# EAGLE schematic PowerElectronicsSchematics (EAGLE 6.5.0)

## Sheet 1 of 6
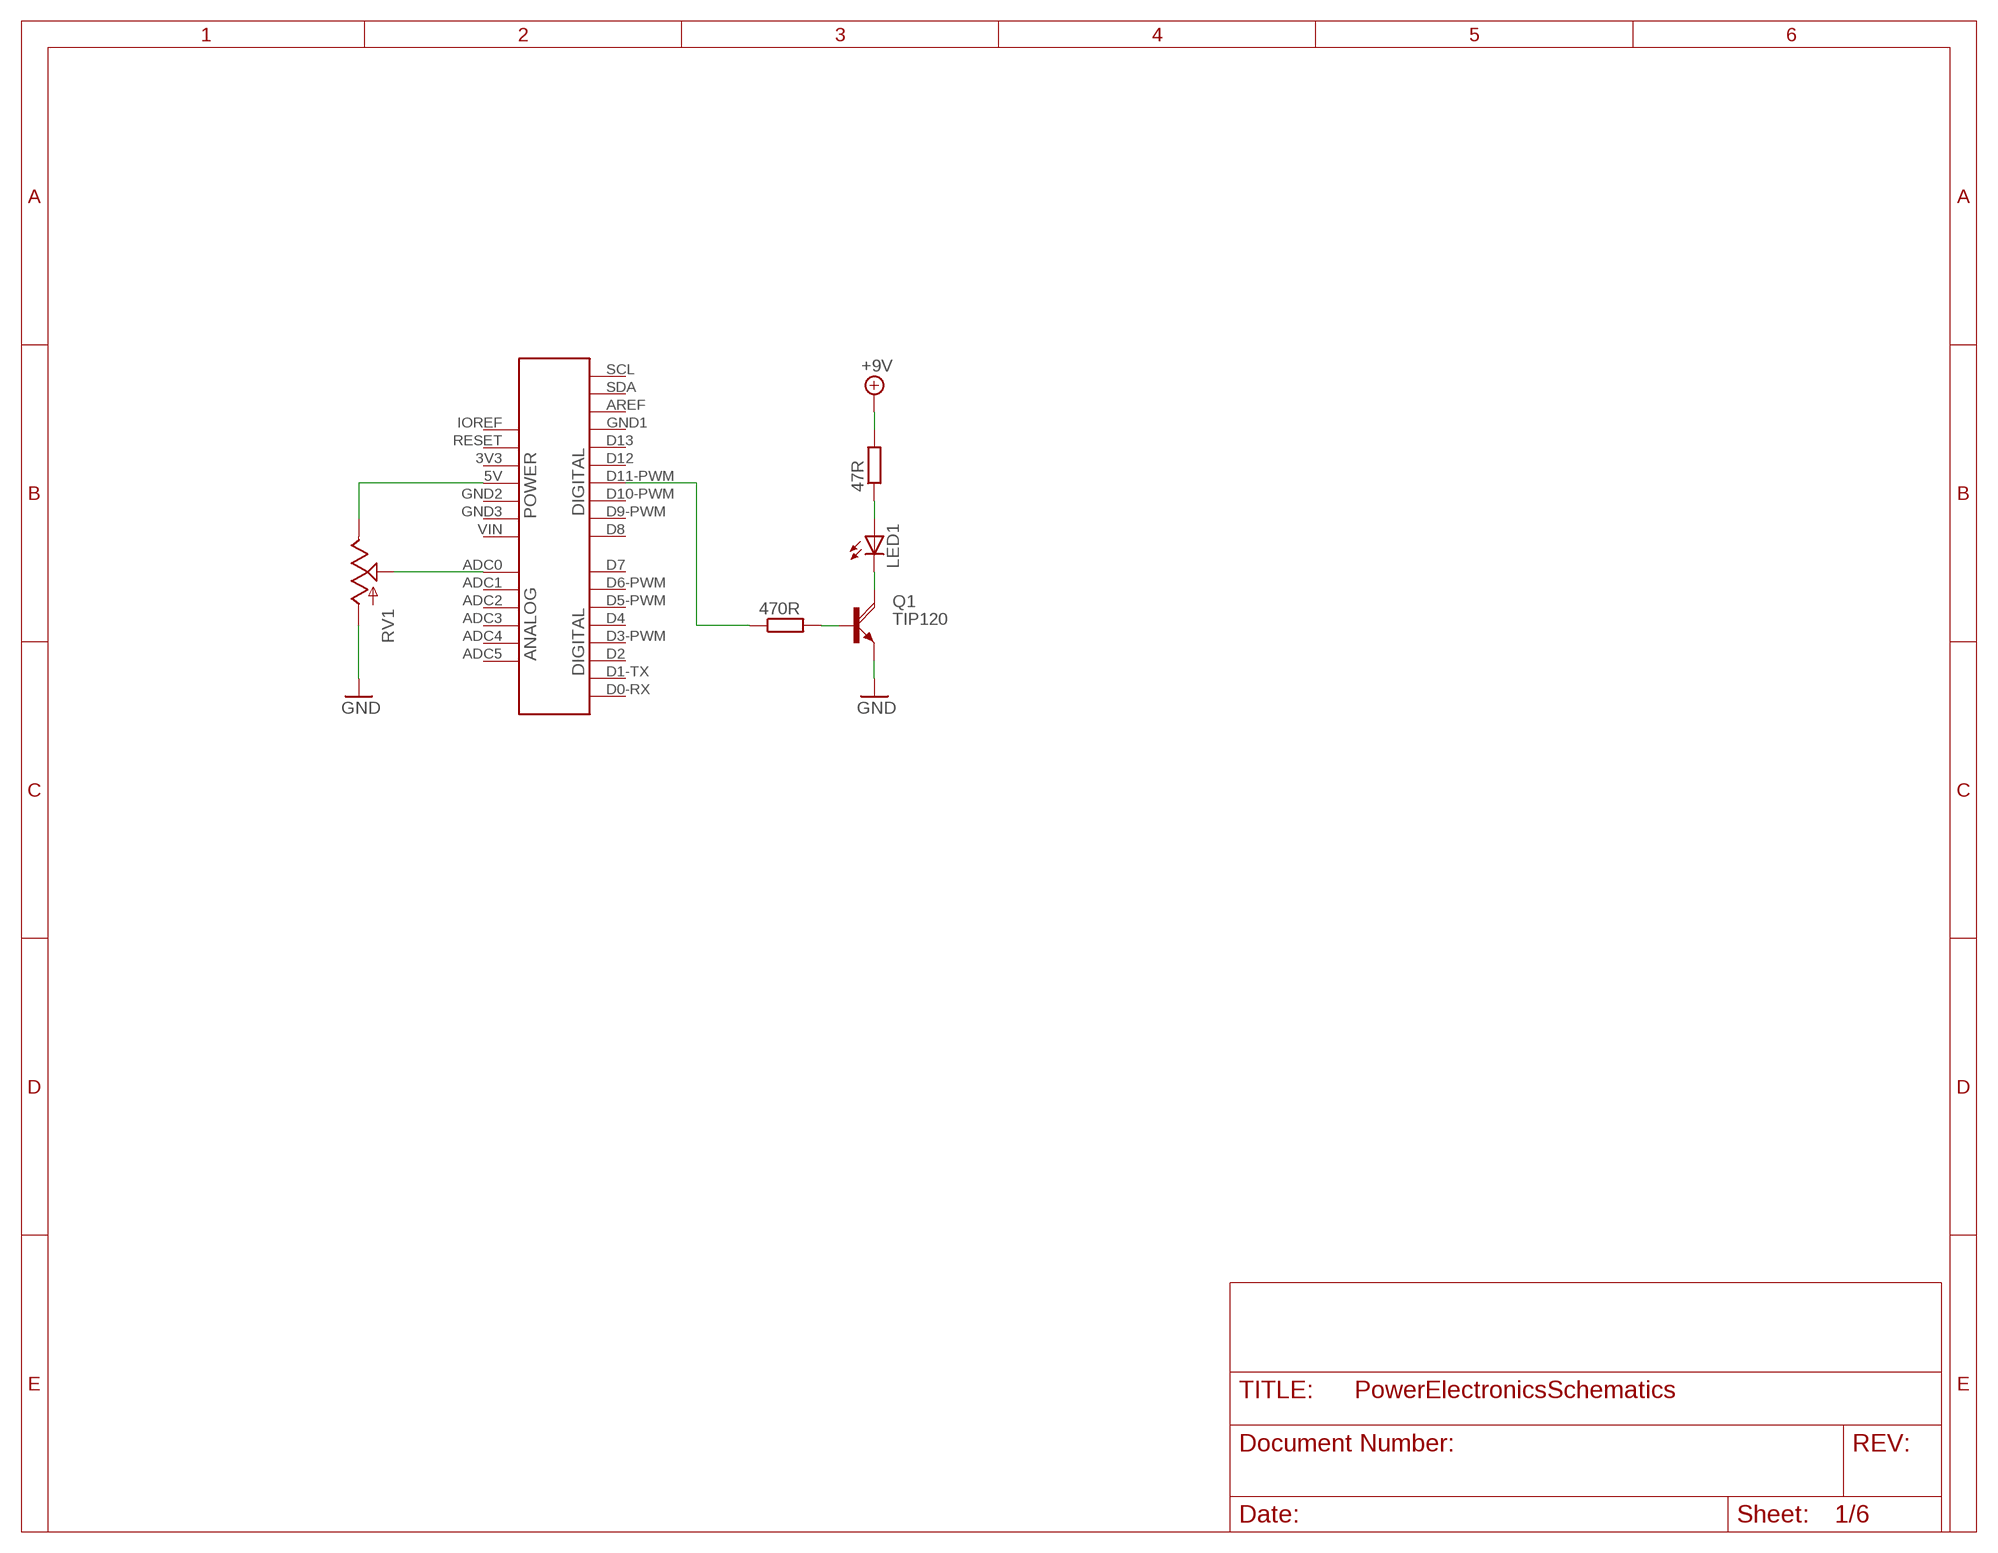
[diagram p0: schematic, sheet 1]

### Parts
47R  R-EU_R0603  [R0603]
470R  R-EU_R0603  [R0603]
ARD1  UNO-R3  [UNO-R3]
LED1  LEDB155  [Q62902-B155]
Q1  TIP120  [TO220AH]
RV1  POT  [ALPS_POT]

### Nets
+9V: 47R.2 ; also sheet 2,3,4,5,6
GND: Q1.E RV1.P$3(A) ; also sheet 2,3,4,5,6
N$1: 470R.1 ARD1.D11-PWM(D11)
N$2: 470R.2 Q1.B
N$3: 47R.1 LED1.A
N$4: LED1.K(C) Q1.C
N$5: ARD1.ADC0 RV1.P$2(S)
N$6: ARD1.5V RV1.P$1(E)
Unconnected: ARD1.3V3 ARD1.ADC1 ARD1.ADC2 ARD1.ADC3 ARD1.ADC4 ARD1.ADC5 ARD1.AREF ARD1.D0-RX(D0) ARD1.D1-TX(D1) ARD1.D2 ARD1.D3-PWM(D3) ARD1.D4 ARD1.D5-PWM(D5) ARD1.D6-PWM(D6) ARD1.D7 ARD1.D8 ARD1.D9-PWM(D9) ARD1.D10-PWM(D10) ARD1.D12 ARD1.D13 ARD1.GND1 ARD1.GND2 ARD1.GND3 ARD1.IOREF ARD1.RESET ARD1.SCL ARD1.SDA ARD1.VIN

## Sheet 2 of 6
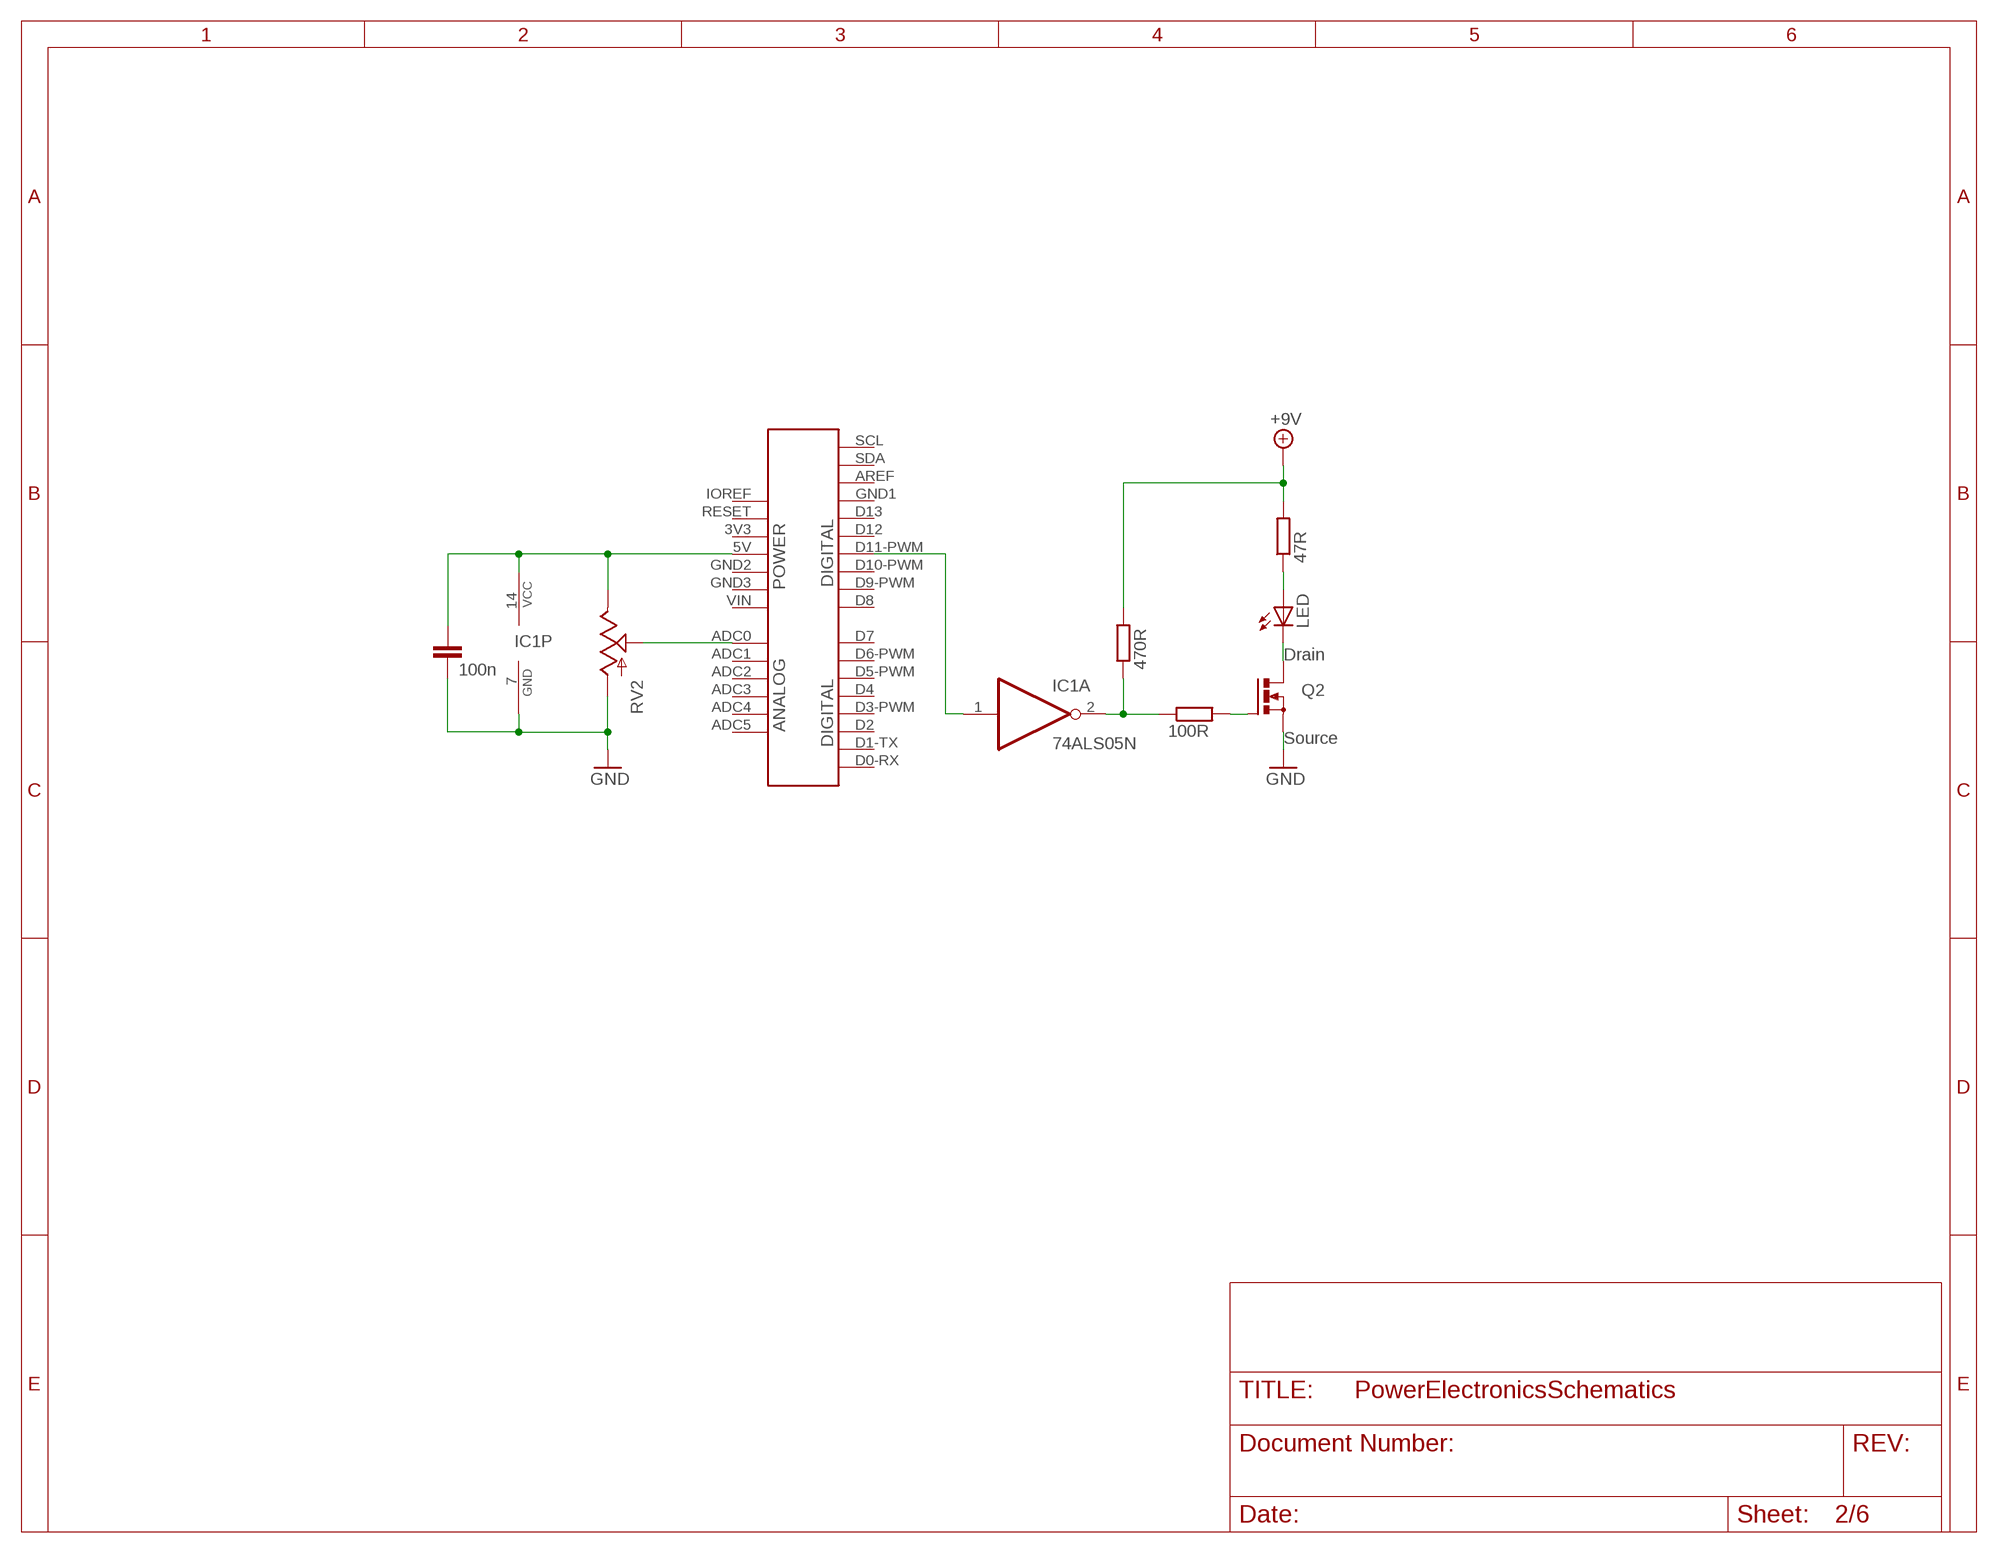
[diagram p1: schematic, sheet 2]

### Parts
47R1  47R  R-EU_R0603  [R0603]
470R1  100R  R-EU_R0603  [R0603]
470R2  470R  R-EU_R0603  [R0603]
ARD2  UNO-R3  [UNO-R3]
C1  100n  C-EUC0603  [C0603]
IC1  74ALS05N  [DIL14]
LED2  LED  LEDB155  [Q62902-B155]
Q2  P3N100FI  [IW220B]
RV2  POT  [ALPS_POT]

### Nets
+9V: 47R1.2 470R2.2 ; also sheet 1,3,4,5,6
GND: C1.2 IC1.7(P:GND) Q2.S RV2.P$3(A) ; also sheet 1,3,4,5,6
N$7: ARD2.D11-PWM(D11) IC1.1(A:I)
N$8: LED2.K(C) Q2.D
N$9: 47R1.1 LED2.A
N$10: 470R1.2 Q2.G
N$11: ARD2.ADC0 RV2.P$2(S)
N$12: ARD2.5V C1.1 IC1.14(P:VCC) RV2.P$1(E)
N$13: 470R1.1 470R2.1 IC1.2(A:O)
Unconnected: ARD2.3V3 ARD2.ADC1 ARD2.ADC2 ARD2.ADC3 ARD2.ADC4 ARD2.ADC5 ARD2.AREF ARD2.D0-RX(D0) ARD2.D1-TX(D1) ARD2.D2 ARD2.D3-PWM(D3) ARD2.D4 ARD2.D5-PWM(D5) ARD2.D6-PWM(D6) ARD2.D7 ARD2.D8 ARD2.D9-PWM(D9) ARD2.D10-PWM(D10) ARD2.D12 ARD2.D13 ARD2.GND1 ARD2.GND2 ARD2.GND3 ARD2.IOREF ARD2.RESET ARD2.SCL ARD2.SDA ARD2.VIN IC1.3(B:I) IC1.4(B:O) IC1.5(C:I) IC1.6(C:O) IC1.8(D:O) IC1.9(D:I) IC1.10(E:O) IC1.11(E:I) IC1.12(F:O) IC1.13(F:I)

### Notes on the sheet
- Drain
- Source

## Sheet 3 of 6
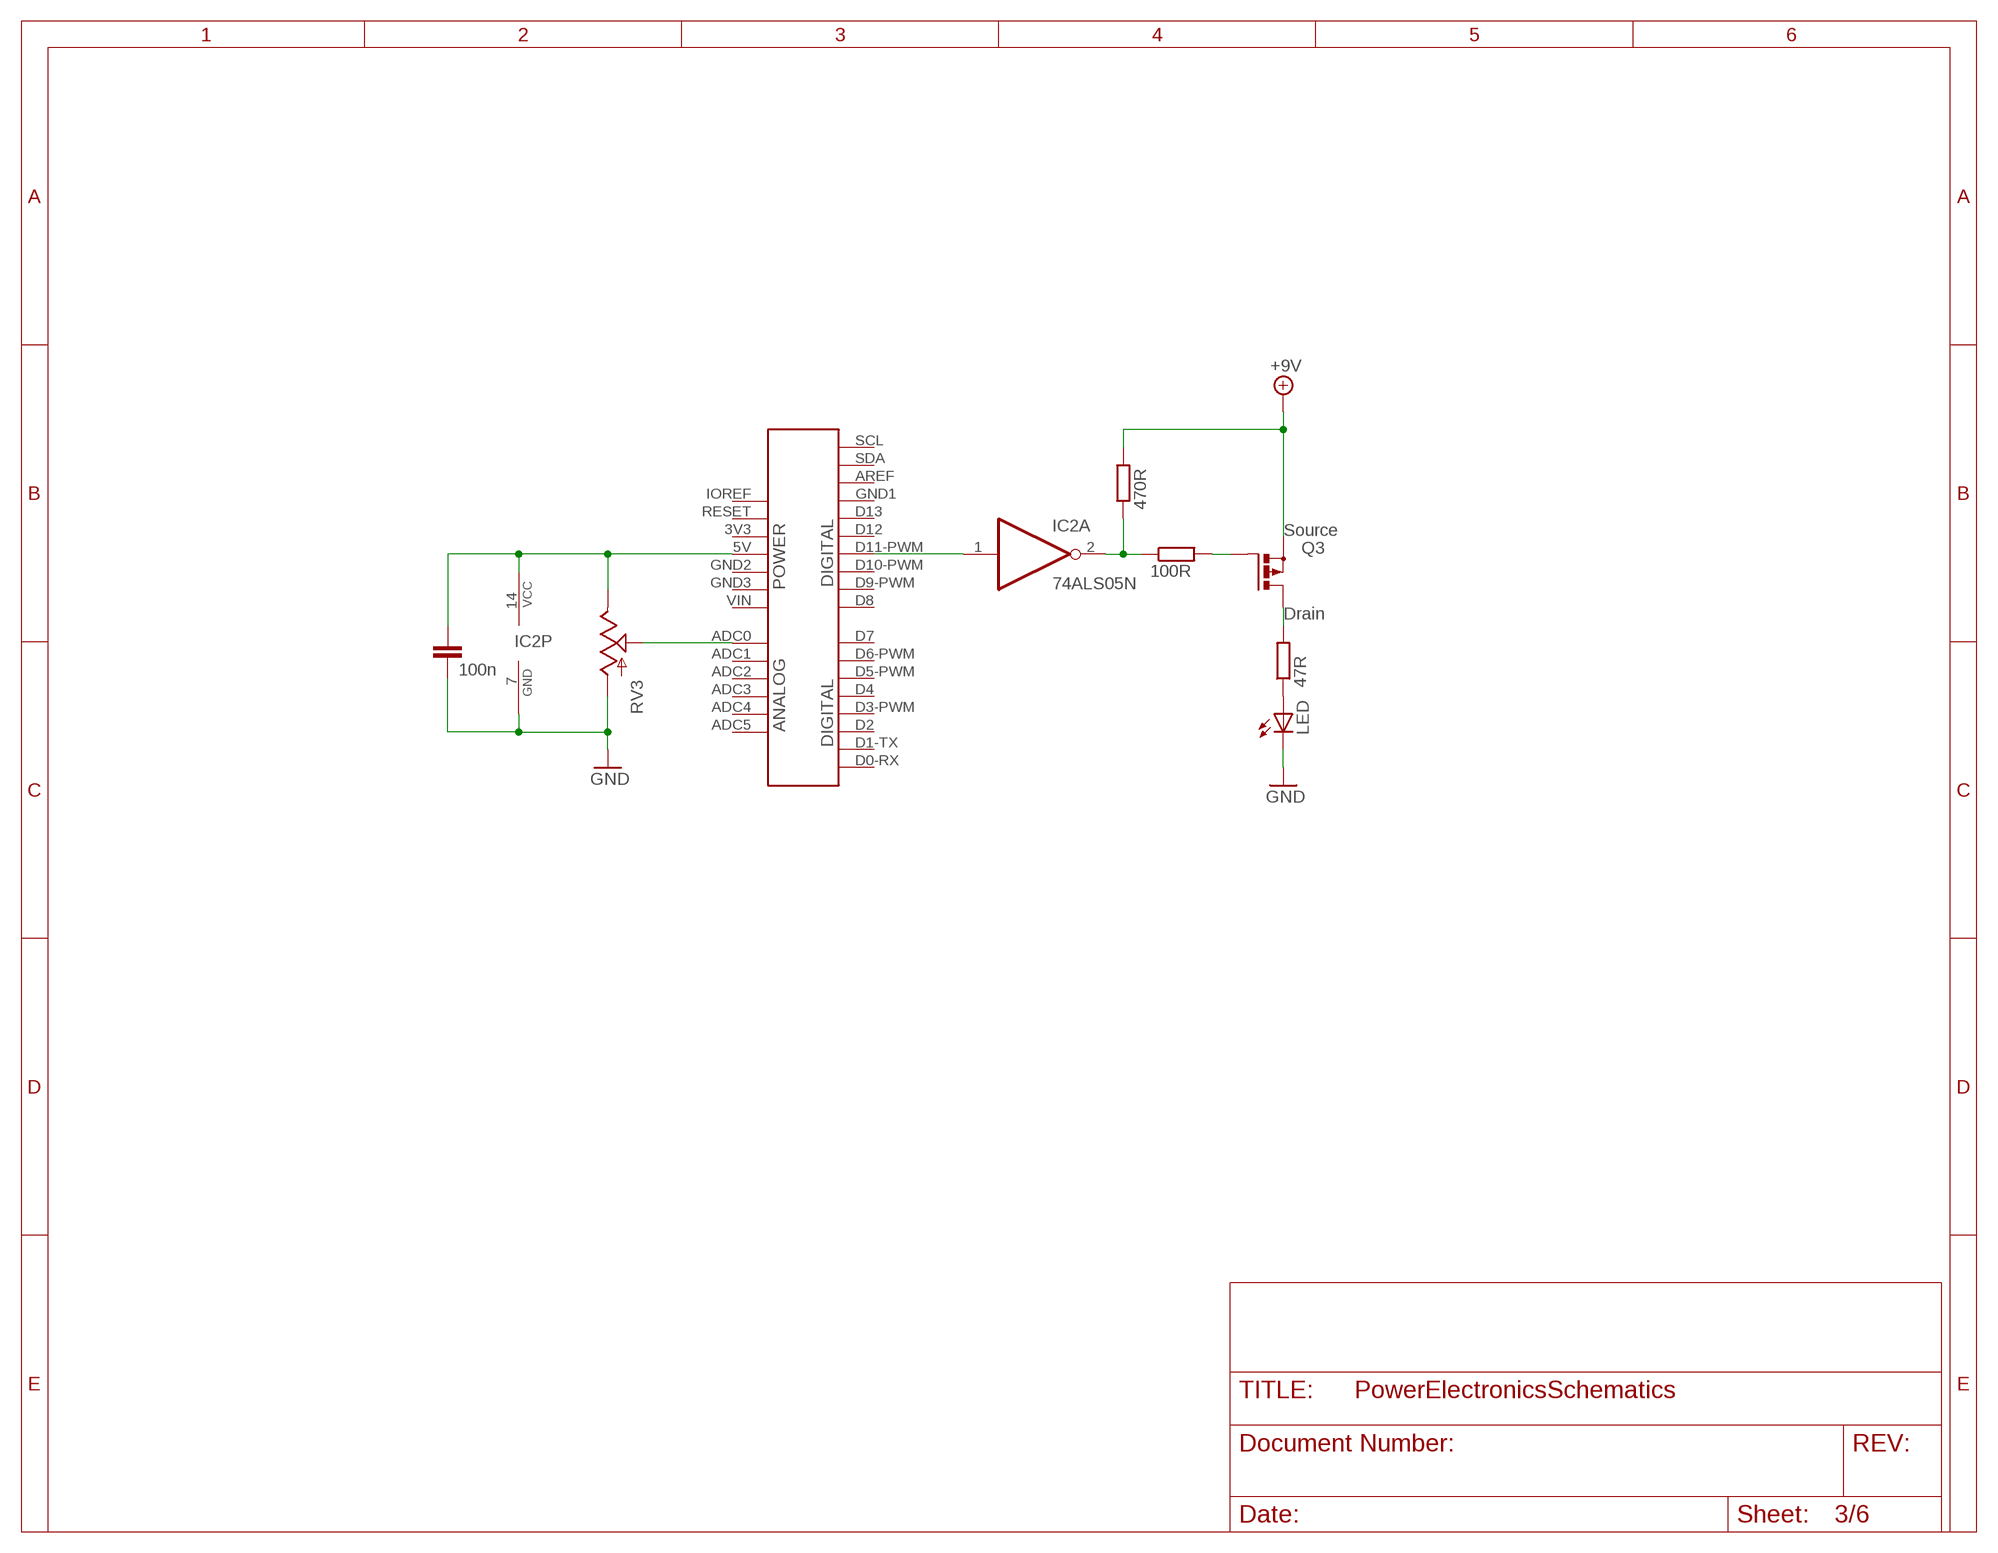
[diagram p2: schematic, sheet 3]

### Parts
47R2  47R  R-EU_R0603  [R0603]
470R3  100R  R-EU_R0603  [R0603]
470R4  470R  R-EU_R0603  [R0603]
ARD3  UNO-R3  [UNO-R3]
C2  100n  C-EUC0603  [C0603]
IC2  74ALS05N  [DIL14]
LED3  LED  LEDB155  [Q62902-B155]
Q3  P-MOSFET-SO8  [SO-08]
RV3  POT  [ALPS_POT]

### Nets
+9V: 470R4.2 Q3.1(S) Q3.2(S) Q3.3(S) ; also sheet 1,2,4,5,6
GND: C2.2 IC2.7(P:GND) LED3.K(C) RV3.P$3(A) ; also sheet 1,2,4,5,6
N$14: ARD3.D11-PWM(D11) IC2.1(A:I)
N$15: 47R2.1 LED3.A
N$16: ARD3.ADC0 RV3.P$2(S)
N$17: ARD3.5V C2.1 IC2.14(P:VCC) RV3.P$1(E)
N$18: 47R2.2 Q3.5(D) Q3.6(D) Q3.7(D) Q3.8(D)
N$19: 470R3.2 Q3.4(G)
N$20: 470R3.1 470R4.1 IC2.2(A:O)
Unconnected: ARD3.3V3 ARD3.ADC1 ARD3.ADC2 ARD3.ADC3 ARD3.ADC4 ARD3.ADC5 ARD3.AREF ARD3.D0-RX(D0) ARD3.D1-TX(D1) ARD3.D2 ARD3.D3-PWM(D3) ARD3.D4 ARD3.D5-PWM(D5) ARD3.D6-PWM(D6) ARD3.D7 ARD3.D8 ARD3.D9-PWM(D9) ARD3.D10-PWM(D10) ARD3.D12 ARD3.D13 ARD3.GND1 ARD3.GND2 ARD3.GND3 ARD3.IOREF ARD3.RESET ARD3.SCL ARD3.SDA ARD3.VIN IC2.3(B:I) IC2.4(B:O) IC2.5(C:I) IC2.6(C:O) IC2.8(D:O) IC2.9(D:I) IC2.10(E:O) IC2.11(E:I) IC2.12(F:O) IC2.13(F:I)

### Notes on the sheet
- Source
- Drain

## Sheet 4 of 6
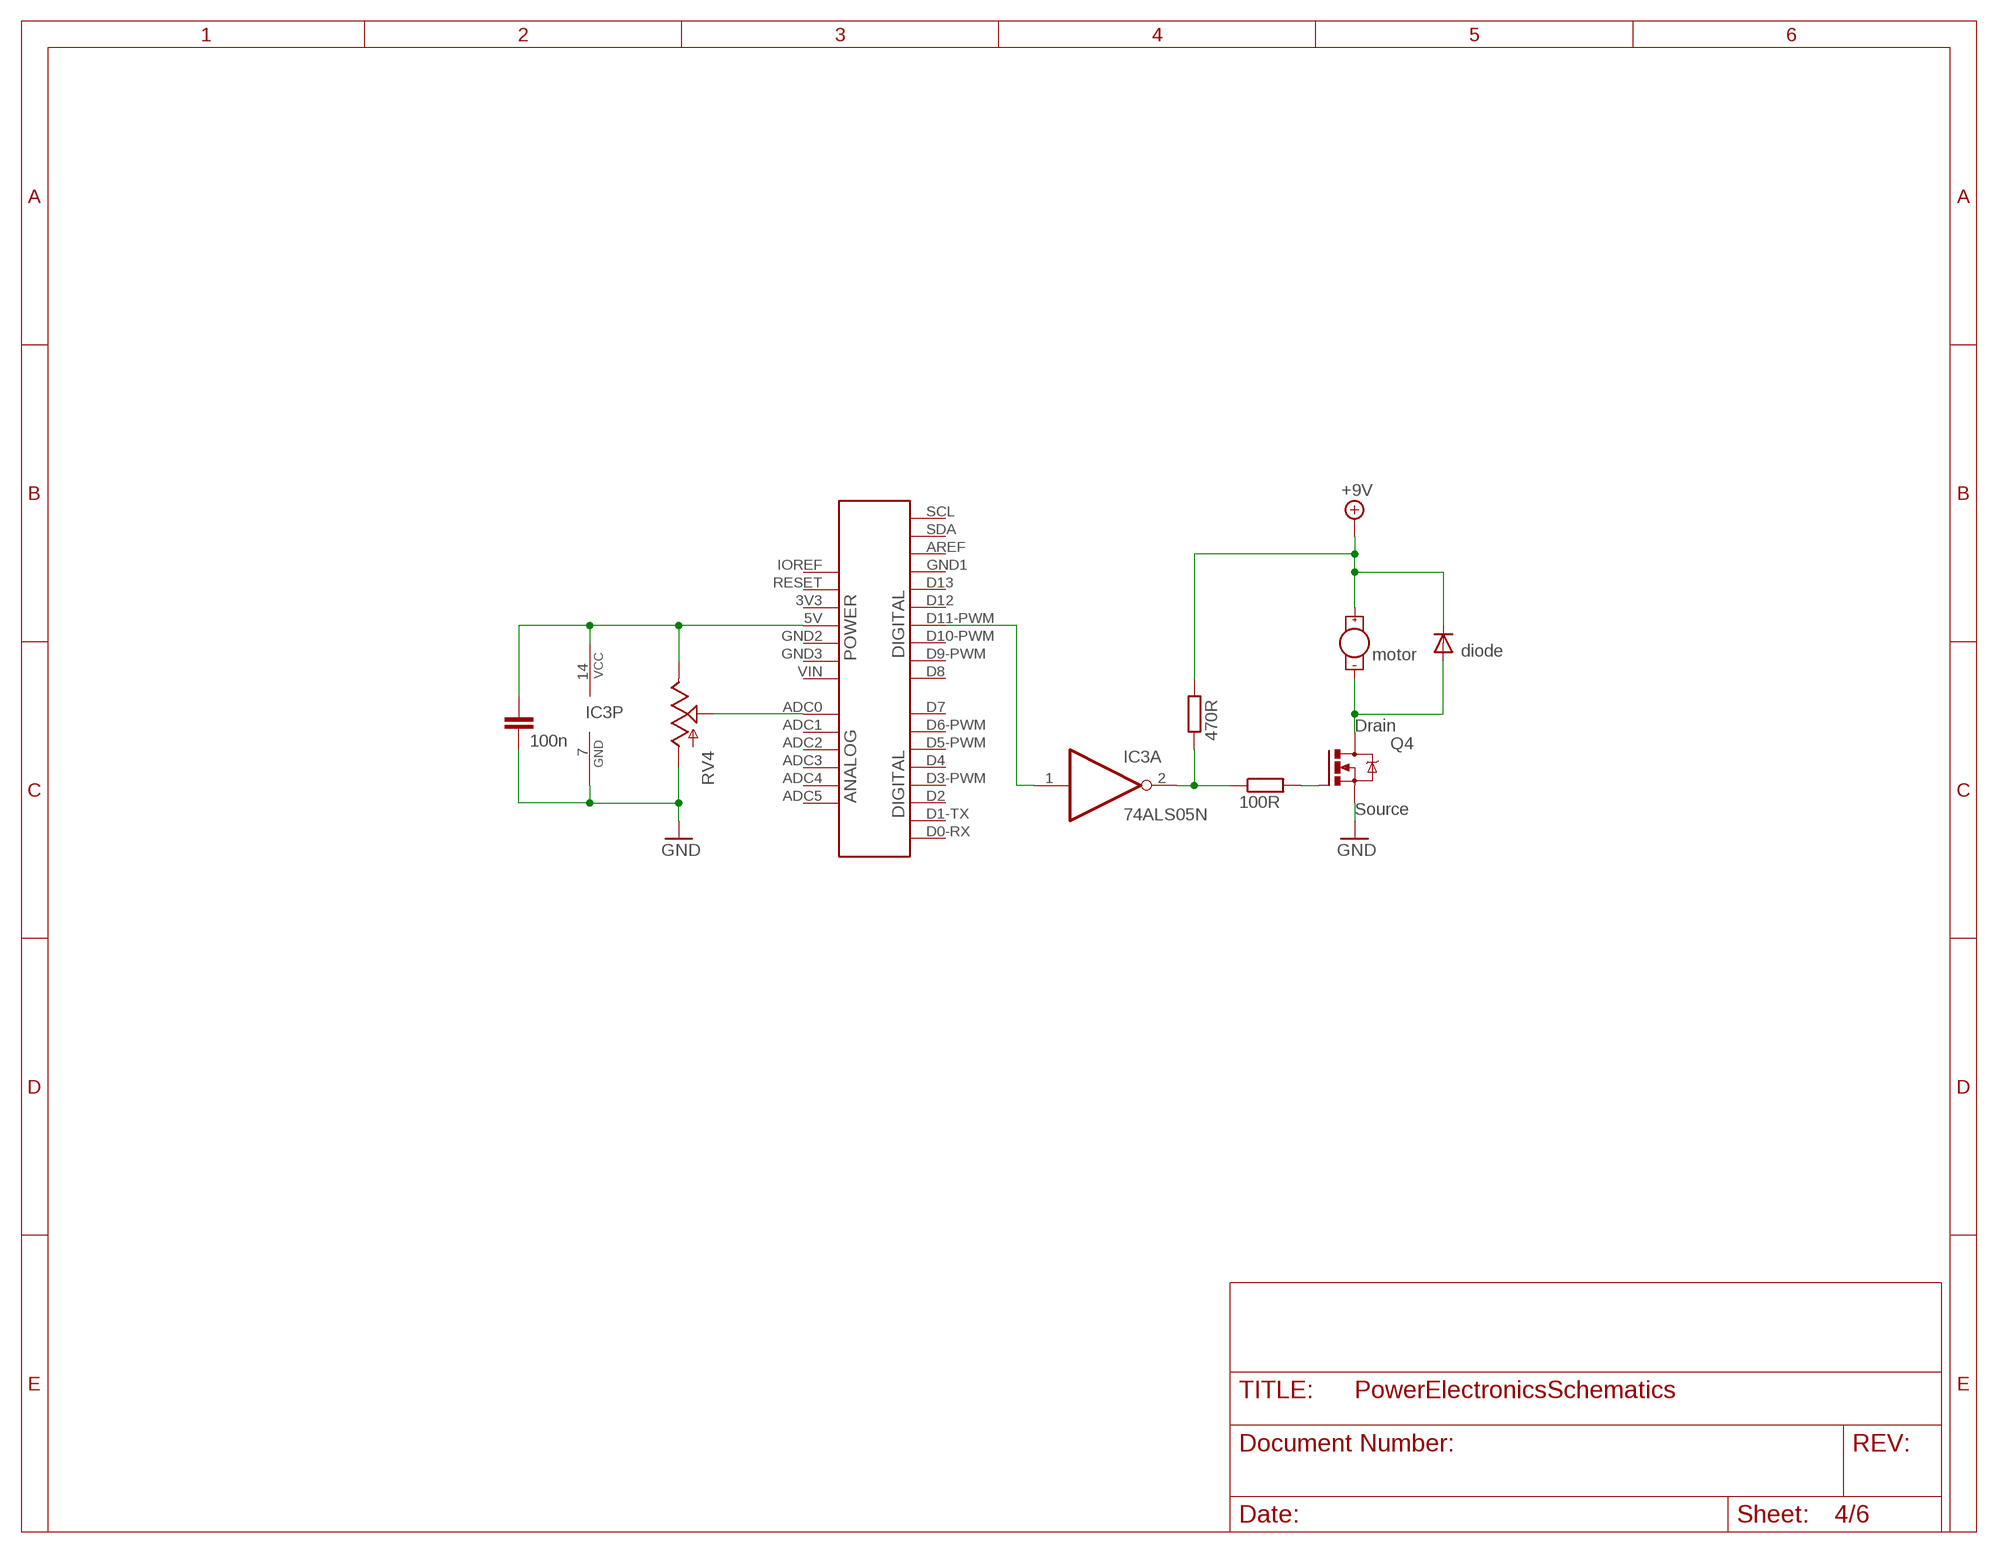
[diagram p3: schematic, sheet 4]

### Parts
470R5  100R  R-EU_R0603  [R0603]
470R6  470R  R-EU_R0603  [R0603]
ARD4  UNO-R3  [UNO-R3]
C3  100n  C-EUC0603  [C0603]
D1  diode  1N4933  [DO41-10]
IC3  74ALS05N  [DIL14]
Q4  IRF540  [TO220BV]
RV4  POT  [ALPS_POT]
U$1  motor  MOTOR10MM  [VIBE-MOTOR-10MM]

### Nets
+9V: 470R6.2 D1.C U$1.+ ; also sheet 1,2,3,5,6
GND: C3.2 IC3.7(P:GND) Q4.S RV4.P$3(A) ; also sheet 1,2,3,5,6
N$21: ARD4.D11-PWM(D11) IC3.1(A:I)
N$23: ARD4.ADC0 RV4.P$2(S)
N$24: ARD4.5V C3.1 IC3.14(P:VCC) RV4.P$1(E)
N$25: D1.A Q4.D U$1.-
N$26: 470R5.2 Q4.G
N$27: 470R5.1 470R6.1 IC3.2(A:O)
Unconnected: ARD4.3V3 ARD4.ADC1 ARD4.ADC2 ARD4.ADC3 ARD4.ADC4 ARD4.ADC5 ARD4.AREF ARD4.D0-RX(D0) ARD4.D1-TX(D1) ARD4.D2 ARD4.D3-PWM(D3) ARD4.D4 ARD4.D5-PWM(D5) ARD4.D6-PWM(D6) ARD4.D7 ARD4.D8 ARD4.D9-PWM(D9) ARD4.D10-PWM(D10) ARD4.D12 ARD4.D13 ARD4.GND1 ARD4.GND2 ARD4.GND3 ARD4.IOREF ARD4.RESET ARD4.SCL ARD4.SDA ARD4.VIN IC3.3(B:I) IC3.4(B:O) IC3.5(C:I) IC3.6(C:O) IC3.8(D:O) IC3.9(D:I) IC3.10(E:O) IC3.11(E:I) IC3.12(F:O) IC3.13(F:I)

### Notes on the sheet
- Drain
- Source

## Sheet 5 of 6
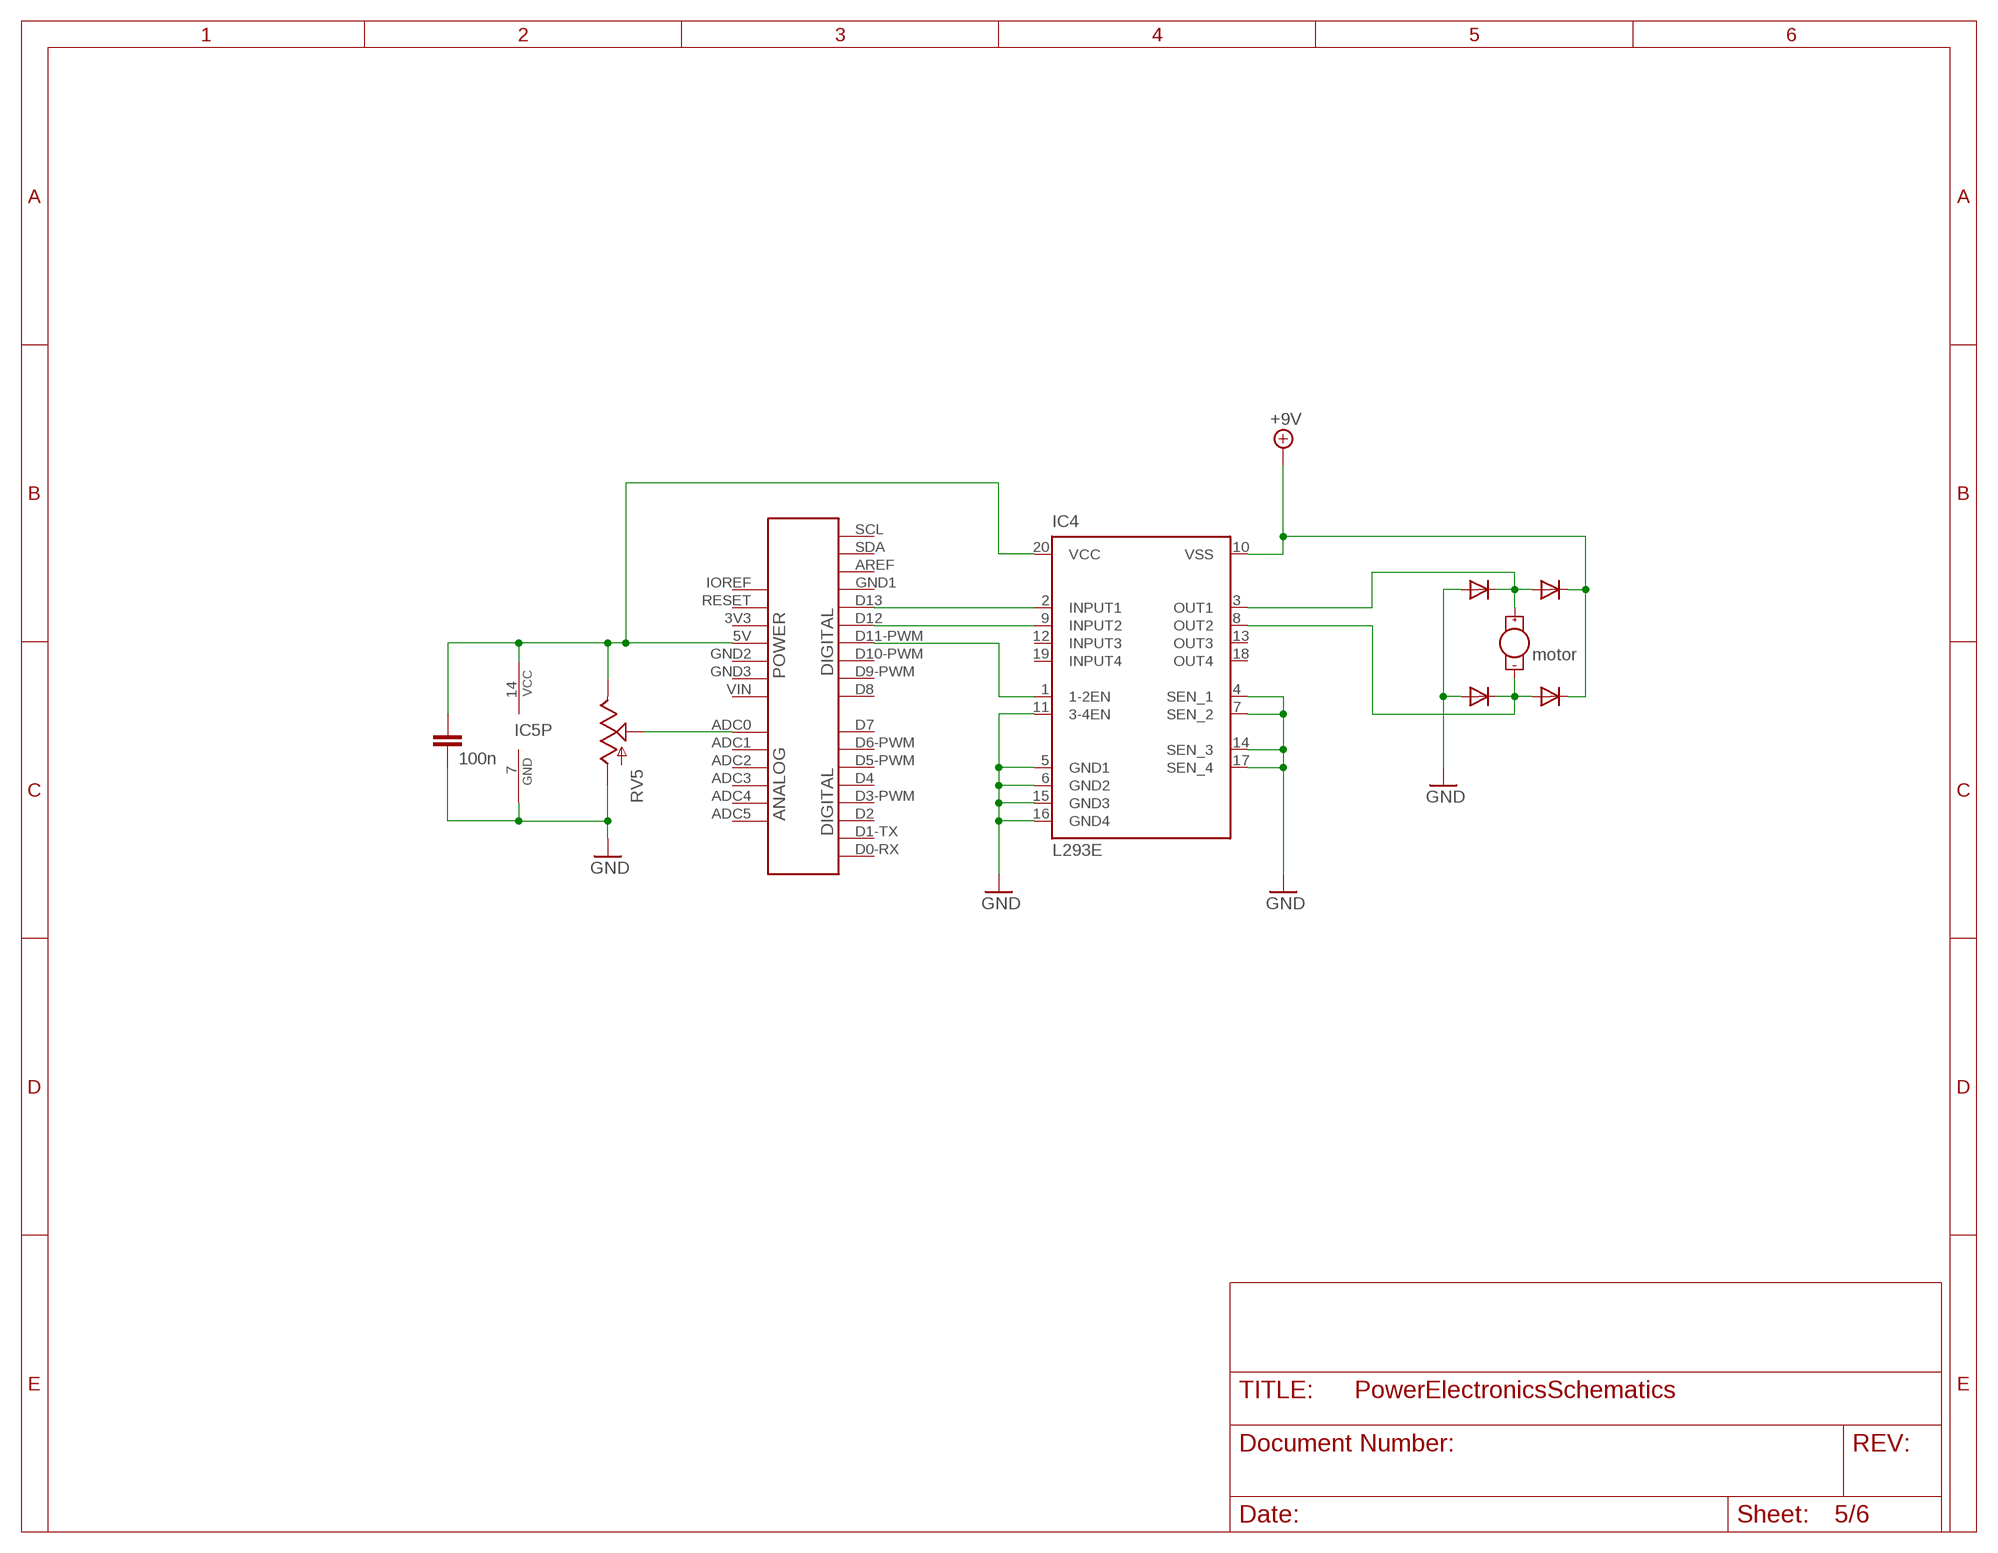
[diagram p4: schematic, sheet 5]

### Parts
ARD5  UNO-R3  [UNO-R3]
C4  100n  C-EUC0603  [C0603]
D2  diode  1N4933  [DO41-10]
D3  diode  1N4933  [DO41-10]
D4  diode  1N4933  [DO41-10]
D5  diode  1N4933  [DO41-10]
IC4  L293E  [DIL20]
IC5  74ALS05N  [DIL14]
RV5  POT  [ALPS_POT]
U$2  motor  MOTOR10MM  [VIBE-MOTOR-10MM]

### Nets
+9V: D2.C D4.C IC4.10(VSS) ; also sheet 1,2,3,4,6
+9V1: D2.A D3.C IC4.3(OUT1) U$2.+
GND: C4.2 D3.A D5.A IC4.4(SEN_1) IC4.5(GND1) IC4.6(GND2) IC4.7(SEN_2) IC4.11(3-4EN) IC4.14(SEN_3) IC4.15(GND3) IC4.16(GND4) IC4.17(SEN_4) IC5.7(P:GND) RV5.P$3(A) ; also sheet 1,2,3,4,6
N$22: ARD5.D11-PWM(D11) IC4.1(1-2EN)
N$28: ARD5.ADC0 RV5.P$2(S)
N$29: ARD5.5V C4.1 IC4.20(VCC) IC5.14(P:VCC) RV5.P$1(E)
N$30: ARD5.D13 IC4.2(INPUT1)
N$31: ARD5.D12 IC4.9(INPUT2)
N$33: D4.A D5.C IC4.8(OUT2) U$2.-
Unconnected: ARD5.3V3 ARD5.ADC1 ARD5.ADC2 ARD5.ADC3 ARD5.ADC4 ARD5.ADC5 ARD5.AREF ARD5.D0-RX(D0) ARD5.D1-TX(D1) ARD5.D2 ARD5.D3-PWM(D3) ARD5.D4 ARD5.D5-PWM(D5) ARD5.D6-PWM(D6) ARD5.D7 ARD5.D8 ARD5.D9-PWM(D9) ARD5.D10-PWM(D10) ARD5.GND1 ARD5.GND2 ARD5.GND3 ARD5.IOREF ARD5.RESET ARD5.SCL ARD5.SDA ARD5.VIN IC4.12(INPUT3) IC4.13(OUT3) IC4.18(OUT4) IC4.19(INPUT4) IC5.1(A:I) IC5.2(A:O) IC5.3(B:I) IC5.4(B:O) IC5.5(C:I) IC5.6(C:O) IC5.8(D:O) IC5.9(D:I) IC5.10(E:O) IC5.11(E:I) IC5.12(F:O) IC5.13(F:I)

## Sheet 6 of 6
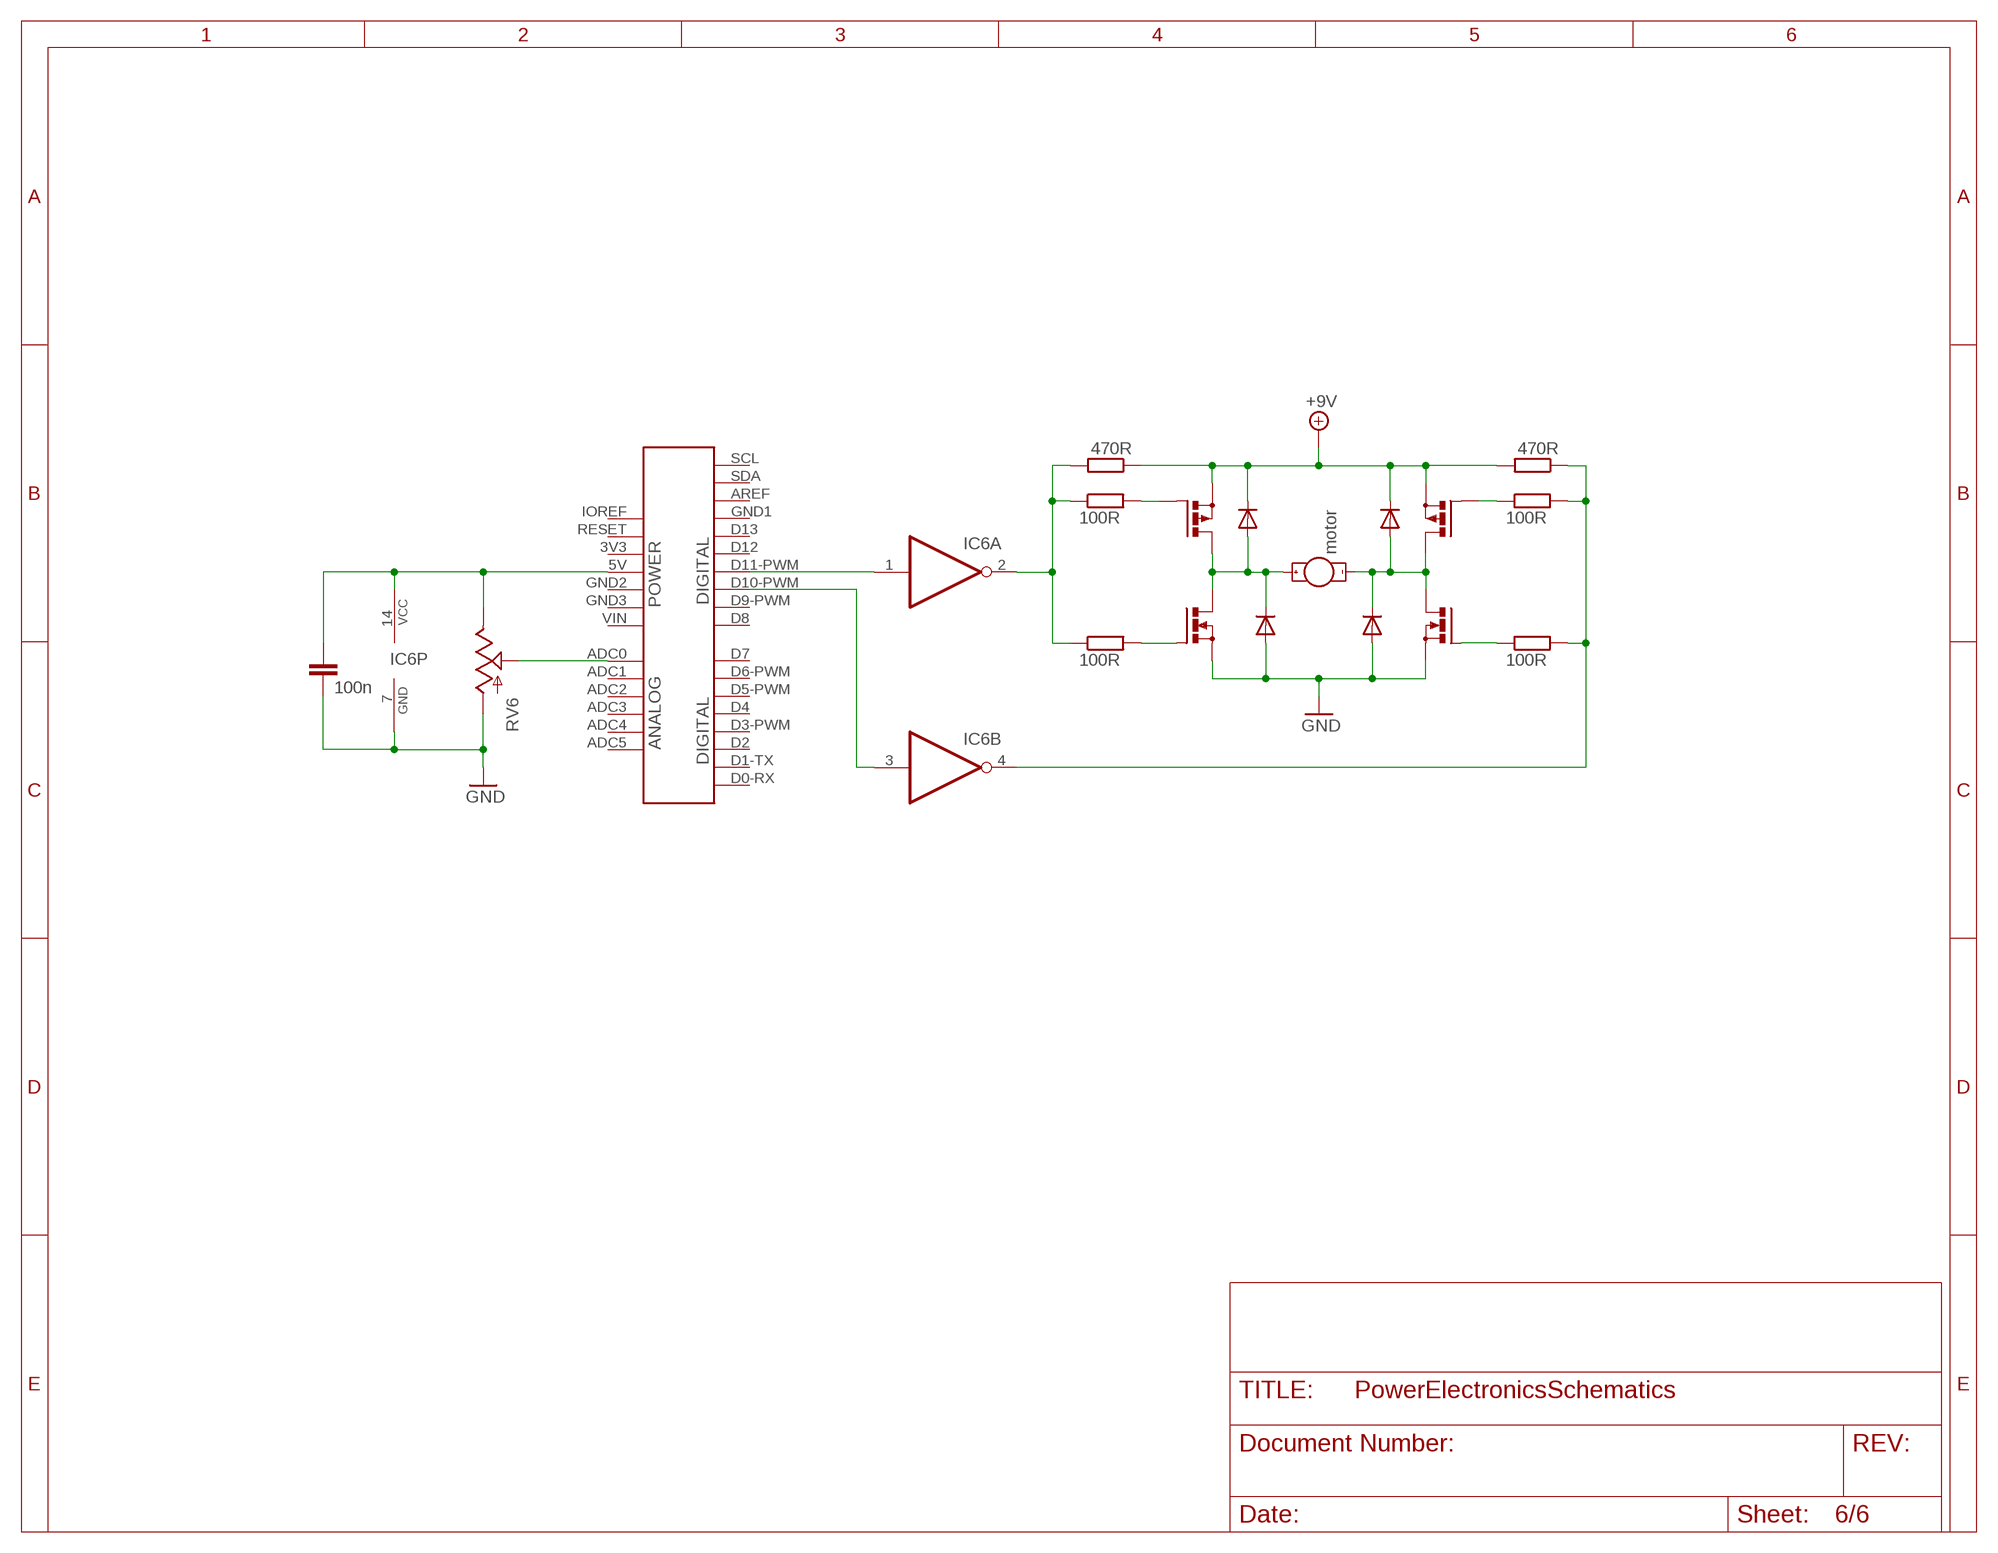
[diagram p5: schematic, sheet 6]

### Parts
470R7  100R  R-EU_R0603  [R0603]
470R8  470R  R-EU_R0603  [R0603]
470R9  100R  R-EU_R0603  [R0603]
470R10  100R  R-EU_R0603  [R0603]
470R11  470R  R-EU_R0603  [R0603]
470R12  100R  R-EU_R0603  [R0603]
ARD6  UNO-R3  [UNO-R3]
C5  100n  C-EUC0603  [C0603]
D6  diode  1N4933  [DO41-10]
D7  diode  1N4933  [DO41-10]
D8  diode  1N4933  [DO41-10]
D9  diode  1N4933  [DO41-10]
IC6  74ALS05N  [DIL14]
Q5  IRF512  [TO220BV]
Q6  IRF512  [TO220BV]
Q7  PMOSFET_PTO220BH  [TO220BH]
Q8  PMOSFET_PTO220BH  [TO220BH]
RV6  POT  [ALPS_POT]
U$3  motor  MOTOR10MM  [VIBE-MOTOR-10MM]

### Nets
+9V: 470R8.1 470R11.2 D6.C D8.C Q7.S Q8.S ; also sheet 1,2,3,4,5
+9V3: D6.A D7.C Q5.D Q7.D U$3.+
GND: C5.2 D7.A D9.A IC6.7(P:GND) Q5.S Q6.S RV6.P$3(A) ; also sheet 1,2,3,4,5
N$32: 470R9.2 Q5.G
N$34: 470R7.2 Q7.G
N$35: 470R7.1 470R8.2 470R9.1 IC6.2(A:O)
N$36: 470R10.1 Q8.G
N$37: RV6.P$2(S)
N$38: C5.1 IC6.14(P:VCC) RV6.P$1(E)
N$39: ARD6.D11-PWM(D11) IC6.1(A:I)
N$40: ARD6.D10-PWM(D10) IC6.3(B:I)
N$41: D8.A D9.C Q6.D Q8.D U$3.-
N$42: 470R12.1 Q6.G
N$43: 470R10.2 470R11.1 470R12.2 IC6.4(B:O)
Unconnected: ARD6.3V3 ARD6.5V ARD6.ADC0 ARD6.ADC1 ARD6.ADC2 ARD6.ADC3 ARD6.ADC4 ARD6.ADC5 ARD6.AREF ARD6.D0-RX(D0) ARD6.D1-TX(D1) ARD6.D2 ARD6.D3-PWM(D3) ARD6.D4 ARD6.D5-PWM(D5) ARD6.D6-PWM(D6) ARD6.D7 ARD6.D8 ARD6.D9-PWM(D9) ARD6.D12 ARD6.D13 ARD6.GND1 ARD6.GND2 ARD6.GND3 ARD6.IOREF ARD6.RESET ARD6.SCL ARD6.SDA ARD6.VIN IC6.5(C:I) IC6.6(C:O) IC6.8(D:O) IC6.9(D:I) IC6.10(E:O) IC6.11(E:I) IC6.12(F:O) IC6.13(F:I)

## Library data of the parts
47R 47R1 47R2 470R 470R1-470R12 = resistor:R-EU_: RESISTOR, European symbol
ARD1-ARD6 = arduino-shields:UNO-R3
C1-C5 = resistor:C-EU: CAPACITOR, European symbol
D1-D9 = diode:1N4933: DIODE fast recovery rectifier, 1A
IC1-IC3 IC5 IC6 = 74xx-us:74*05: Hex INVERTER, open collector
IC4 = l293e:L293E: PUSH-PULL 4 CHANNEL DRIVER
LED1-LED3 = led:LED: LED OSRAM: - CHIPLED LG R971, LG N971, LY N971, LG Q971, LY Q971, LO R971, LY R971 LH N974, LH R974 LS Q976, LO Q976, LY Q976 LO Q996 - Hyper CHIPLED LW Q18S LB Q993, LB Q99A, LB R99A - SideLED LS A670, LO A670, LY A670, LG A670, LP A670 LB A673, LV A673, LT A673, LW A673 LH A674 LY A675 LS A676, LA A676, LO A676, LY A676, LW A676 LS A679, LY A679, LG A679 - Hyper Micro SIDELED® LS Y876, LA Y876, LO Y876, LY Y876 LT Y87S - SmartLED LW L88C, LW L88S LB L89C, LB L89S, LG L890 LS L89K, LO L89K, LY L89K LS L896, LA L896, LO L896, LY L896 - TOPLED LS T670, LO T670, LY T670, LG T670, LP T670 LSG T670, LSP T670, LSY T670, LOP T670, LYG T670 LG T671, LOG T671, LSG T671 LB T673, LV T673, LT T673, LW T673 LH T674 LS T676, LA T676, LO T676, LY T676, LB T676, LH T676, LSB T676, LW T676 LB T67C, LV T67C, LT T67C, LS T67K, LO T67K, LY T67K, LW E67C LS E67B, LA E67B, LO E67B, LY E67B, LB E67C, LV E67C, LT E67C LW T67C LS T679, LY T679, LG T679 LS T770, LO T770, LY T770, LG T770, LP T770 LB T773, LV T773, LT T773, LW T773 LH T774 LS E675, LA E675, LY E675, LS T675 LS T776, LA T776, LO T776, LY T776, LB T776 LHGB T686 LT T68C, LB T68C - Hyper Mini TOPLED® LB M676 - Mini TOPLED Santana® LG M470 LS M47K, LO M47K, LY M47K Source: http://www.osram.convergy.de LUXEON: - LUMILED® LXK2-PW12-R00, LXK2-PW12-S00, LXK2-PW14-U00, LXK2-PW14-V00 LXK2-PM12-R00, LXK2-PM12-S00, LXK2-PM14-U00 LXK2-PE12-Q00, LXK2-PE12-R00, LXK2-PE12-S00, LXK2-PE14-T00, LXK2-PE14-U00 LXK2-PB12-K00, LXK2-PB12-L00, LXK2-PB12-M00, LXK2-PB14-N00, LXK2-PB14-P00, LXK2-PB14-Q00 LXK2-PR12-L00, LXK2-PR12-M00, LXK2-PR14-Q00, LXK2-PR14-R00 LXK2-PD12-Q00, LXK2-PD12-R00, LXK2-PD12-S00 LXK2-PH12-R00, LXK2-PH12-S00 LXK2-PL12-P00, LXK2-PL12-Q00, LXK2-PL12-R00 Source: www.luxeon.com KINGBRIGHT: KA-3528ASYC Source: www.kingbright.com
Q1 = transistor-power:TIP120: NPN DARLINGTON TRANSISTOR
Q2 = transistor-power:P3N100FI: N-CHANNEL MOS FET
Q3 = transistor-power:P-MOSFET-SO8: P-Channel MOSFET Example: FDS4435A; P-Channel Logic Level PowerTrench® MOSFET FDS4465; P-Channel 1.8V Specified PowerTrench® MOSFET Source: www.fairchildsemi.com
Q4 = transistor-power:IRF540: HEXFET Power MOSFET
Q5 Q6 = transistor-power:IRF512: N-CHANNEL MOS FET
Q7 Q8 = transistor-power:PMOSFET_P: Power MOSFET P-Channel
RV1-RV6 = SparkFun-Electromechanical:POT; PROD_ID: RES-09177
U$1-U$3 = SparkFun-Electromechanical:MOTOR: Vibration Motor- ROB-08449 Physical dimension and wire connections for this powerful vibration motor. Motor has a self adhesive backing.